# Altium schematic sheet Sintetizador1.SchDoc
size A4; SheetNumber: 11; SheetTotal: 13
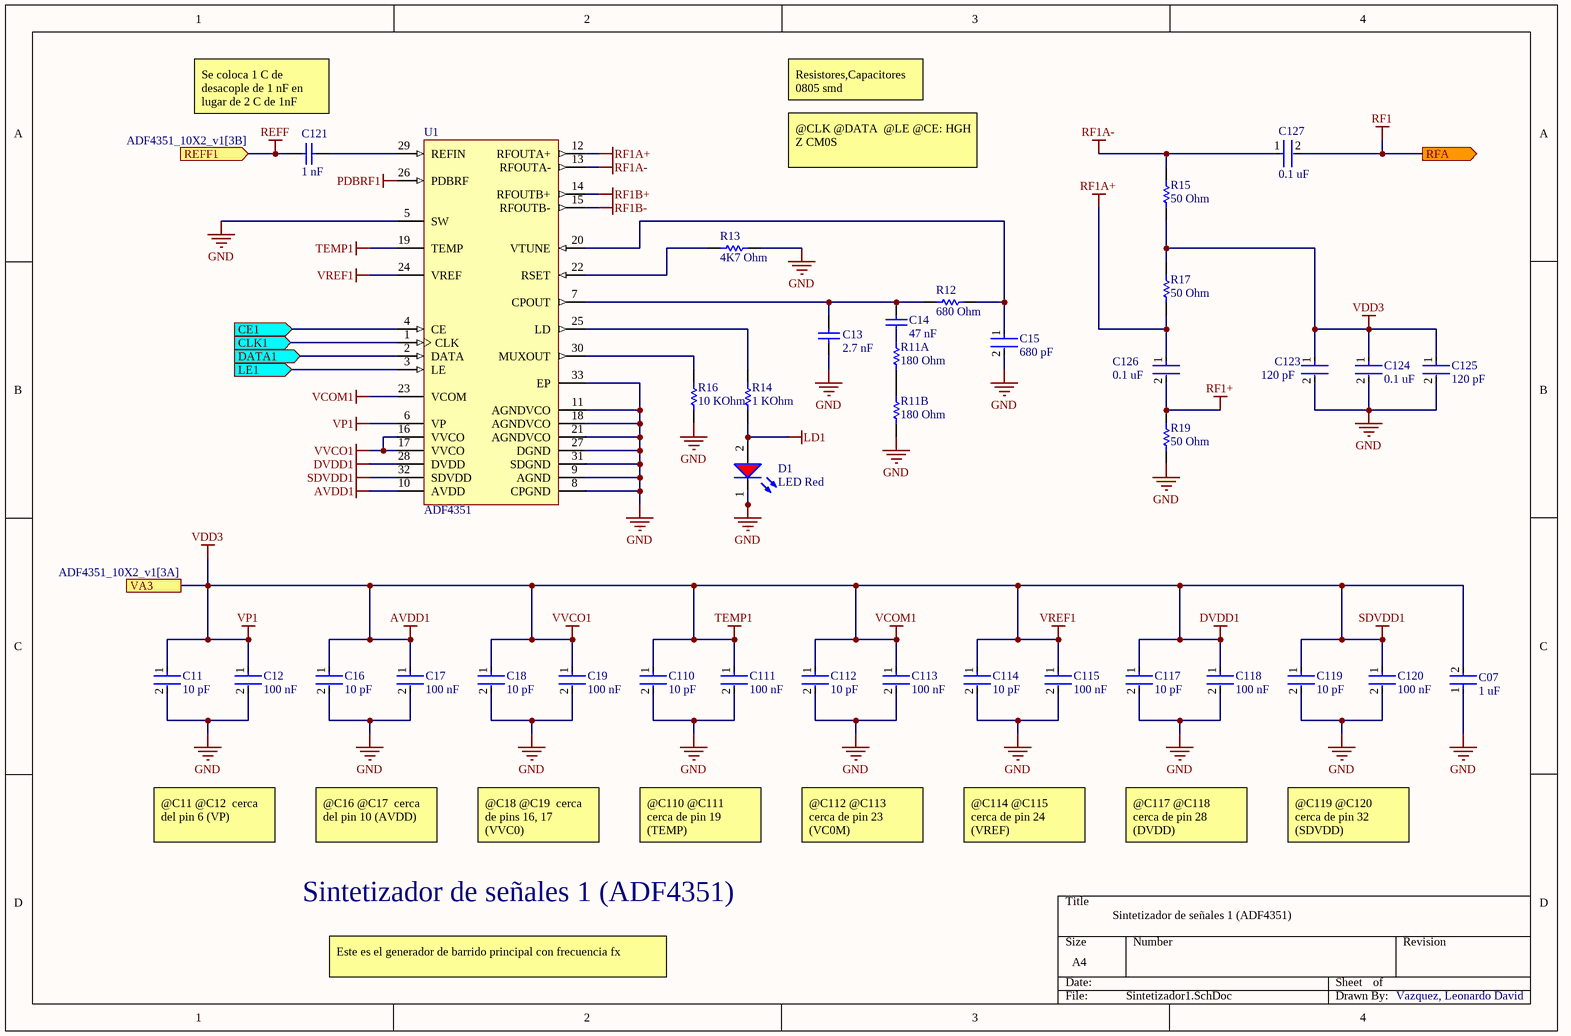
[diagram p0: Sintetizador1.SchDoc]

## Parts
C07  1 uF  [FP-CC0805-0_85-MFG]
C11  10 pF  [FP-CL21-IPC_C]
C12  100 nF  [FP-CL21-IPC_C]
C13  2.7 nF  [CAPC2013X130X50NL20T20]
C14  47 nF  [CAPC2013X100X50ML20T25]
C15  680 pF  [FP-C0805C-DN-MFG]
C16  10 pF  [FP-CL21-IPC_C]
C17  100 nF  [FP-CL21-IPC_C]
C18  10 pF  [FP-CL21-IPC_C]
C19  100 nF  [FP-CL21-IPC_C]
C110  10 pF  [FP-CL21-IPC_C]
C111  100 nF  [FP-CL21-IPC_C]
C112  10 pF  [FP-CL21-IPC_C]
C113  100 nF  [FP-CL21-IPC_C]
C114  10 pF  [FP-CL21-IPC_C]
C115  100 nF  [FP-CL21-IPC_C]
C117  10 pF  [FP-CL21-IPC_C]
C118  100 nF  [FP-CL21-IPC_C]
C119  10 pF  [FP-CL21-IPC_C]
C120  100 nF  [FP-CL21-IPC_C]
C121  1 nF  [CAPC2013X94X50NL20T25]
C123  120 pF  [FP-CC0805-0_85-MFG]
C124  0.1 uF  [FP-CC0805-0_85-MFG]
C125  120 pF  [FP-CC0805-0_85-MFG]
C126  0.1 uF  [FP-CC0805-0_85-MFG]
C127  0.1 uF  [FP-CC0805-0_85-MFG]
D1  LED Red  [WL-SMCW_0805_150080xx75000]
R11A  180 Ohm  [RESC2013X70X40ML20T20]
R11B  180 Ohm  [RESC2013X70X40ML20T20]
R12  680 Ohm  [RESC2013X70X40ML20T20]
R13  4K7 Ohm  [RESC2013X70X40ML20T20]
R14  1 KOhm  [RESC2013X60X40ML20T25]
R15  50 Ohm  [RESC2013X60X40ML20T25]
R16  10 KOhm  [RESC2013X60X40ML20T25]
R17  50 Ohm  [RESC2013X60X40ML20T25]
R19  50 Ohm  [RESC2013X60X40ML20T25]
U1  ADF4351  [ADI-CP-32-2_L]

## Ports
CE1 (in, see ADF4351_10X2_v1[3A], Data_converter[2A]), CLK1 (in, see ADF4351_10X2_v1[3A], Data_converter[2B]), DATA1 (in, see ADF4351_10X2_v1[3A], Data_converter[2B]), LE1 (in, see ADF4351_10X2_v1[3A], Data_converter[2C]), REFF1 (in, see ADF4351_10X2_v1[3B]), RFA (out, see ADF4351_10X2_v1[3A]), VA3 (see ADF4351_10X2_v1[3A])

## Nets
AVDD1: C07.2 C11.1 C12.1 C16.1 C17.1 C18.1 C19.1 C110.1 C111.1 C112.1 C113.1 C114.1 C115.1 C117.1 C118.1 C119.1 C120.1 C123.1 C124.1 C125.1 R15.2 R17.1 U1.6(VP) U1.10(AVDD) U1.16(VVCO) U1.17(VVCO) U1.19(TEMP) U1.23(VCOM) U1.24(VREF) U1.28(DVDD) U1.32(SDVDD) ; port VA3  [also labelled DVDD1, SDVDD1, TEMP1, VCOM1, VDD3, VP1, VREF1, VVCO1]
GND: C07.1 C11.2 C12.2 C13.1 C15.2 C16.2 C17.2 C18.2 C19.2 C110.2 C111.2 C112.2 C113.2 C114.2 C115.2 C117.2 C118.2 C119.2 C120.2 C123.2 C124.2 C125.2 D1.1(K) R11B.1 R13.2 R16.2 R19.2 U1.5(SW) U1.8(CPGND) U1.9(AGND) U1.11(AGNDVCO) U1.18(AGNDVCO) U1.21(AGNDVCO) U1.27(DGND) U1.31(SDGND) U1.33(EP)
LD1: D1.2(A) R14.1
PDBRF1: U1.26(PDBRF)
REFF: C121.1 ; port REFF1
RF1: C127.2 ; port RFA
RF1+: C126.2 R19.1
RF1A+: C126.1 R17.2 U1.12(RFOUTA+)
RF1A-: C127.1 R15.1 U1.13(RFOUTA-)
RF1B+: U1.14(RFOUTB+)
RF1B-: U1.15(RFOUTB-)
CE1: U1.4(CE) ; port CE1
CLK1: U1.1(CLK) ; port CLK1
DATA1: U1.2(DATA) ; port DATA1
LE1: U1.3(LE) ; port LE1
NetC13_2: C13.2 C14.2 R12.1 U1.7(CPOUT)
NetC14_1: C14.1 R11A.2
NetC15_1: C15.1 R12.2 U1.20(VTUNE)
NetC121_2: C121.2 U1.29(REFIN)
NetR11A_2: R11A.2 R11B.1
NetR13_1: R13.1 U1.22(RSET)
NetR14_2: R14.2 U1.25(LD)
NetR16_1: R16.1 U1.30(MUXOUT)

## Notes on the sheet
- (near C121) Se coloca 1 C de desacople de 1 nF en lugar de 2 C de 1nF
- Resistores,Capacitores 0805 smd
  2N3904 SOT-23
- @CLK @DATA  @LE @CE: HGH Z CM0S
- @C11 @C12  cerca del pin 6 (VP)
- @C16 @C17  cerca del pin 10 (AVDD)
- @C18 @C19  cerca de pins 16, 17 (VVC0)
- @C110 @C111  cerca de pin 19 (TEMP)
- @C112 @C113  cerca de pin 23 (VC0M)
- @C114 @C115  cerca de pin 24 (VREF)
- @C117 @C118  cerca de pin 28 (DVDD)
- @C119 @C120  cerca de pin 32 (SDVDD)
- Sintetizador de señales 1 (ADF4351)
- Este es el generador de barrido principal con frecuencia fx
- Vazquez, Leonardo David

## Library data of the parts
C07 C123-C127 = CMP-2100-03606-3: CAP CER 0.1UF 50V X7R 0805; Manufacturer Part Number: CC0805KRX7R9BB104; Manufacturer: Yageo; Tolerance: 0.1; Capacitance: 100 nF; Value: 100 nF; Material: Ceramic; Device Class L1: Passive Components; ComponentLink2Description: Datasheet; Package: CC0805-0.85; Digikey Description: CAP CER 0.1UF 50V X7R 0805; Device Class L3: Ceramic Capacitors; Temperature: -30°C to +85°C; Temperature Characteristic: X7R; Voltage Rating: 50 V; Height: 0.95mm; RoHS: TRUE; Ipc Land Pattern Name: CAPC200125X85; Device Class L2: Capacitors; Category: Cap; Temperature Range Low: -30°C; Temperature Range High: +85°C; Mouser Description: Multilayer Ceramic Capacitors MLCC - SMD/SMT 100nF 50V X7R 10%; Footprint Url: http://www.yageo.com/exep/pages/download/literatures/UPY-C_GEN_24.pdf; Automotive: No; Octopart: https://octopart.com/cc0805krx7r9bb104-yageo-192993; Lead Free: Yes; ComponentLink2URL: http://www.yageo.com/documents/recent/UPY-GPHC_Y5V_6.3V-to-50V_8.pdf
C11 C16 C18 C110 C112 C114 C117 C119 = CMP-13271-003234-1: CL21 Series 0805 10pF 100V ±0.25pF Tolerance C0G Multilayer Ceramic Chip Capacitor; Temperature Coefficient: 300ppm/°C; Length: 2mm; Packaging: Tape and Reel; Width: 0.049inch; Thickness: 0.03inch; Depth: 1.25mm; Case Code (Imperial): 0805; Package Quantity: 1; Capacitance: 10pF; Voltage: 100V; Case Code (Metric): 2012; Dielectric: C0G; Voltage Rating: 100V; Case/Package: 0805; Height: 0.65mm; Mount: Surface Mount; Radiation Hardening: No; Max Operating Temperature: 125°C; Voltage Rating (DC): 100V; Min Operating Temperature: -55°C; Material: Ceramic
C12 C17 C19 C111 C113 C115 C118 C120 = CMP-2100-03606-3: CAP CER 0.1UF 50V X7R 0805; Manufacturer Part Number: CC0805KRX7R9BB104; Manufacturer: Yageo; Tolerance: 0.1; Material: Ceramic; Device Class L1: Passive Components; ComponentLink2Description: Datasheet; Package: CC0805-0.85; Digikey Description: CAP CER 0.1UF 50V X7R 0805; Capacitance: 100 nF; Device Class L3: Ceramic Capacitors; Value: 100 nF; Temperature: -30°C to +85°C; Temperature Characteristic: X7R; Voltage Rating: 50 V; Height: 0.95mm; RoHS: TRUE; Ipc Land Pattern Name: CAPC200125X85; Device Class L2: Capacitors; Category: Cap; Temperature Range Low: -30°C; Temperature Range High: +85°C; Mouser Description: Multilayer Ceramic Capacitors MLCC - SMD/SMT 100nF 50V X7R 10%; Footprint Url: http://www.yageo.com/exep/pages/download/literatures/UPY-C_GEN_24.pdf; Automotive: No; Octopart: https://octopart.com/cc0805krx7r9bb104-yageo-192993; Lead Free: Yes; ComponentLink2URL: http://www.yageo.com/documents/recent/UPY-GPHC_Y5V_6.3V-to-50V_8.pdf
C13 = CMP-2007-03635-1: Part Number: CDR31BX272BKMSAJ; Manufacturer: Vitramon
C14 = CMP-2007-03713-1: Manufacturer: Kemet; Part Number: C0805F473K5RACTU
C15 = CMP-1036-02839-3: CAP CER 680PF 100V 5% NP0 0805; Manufacturer: KEMET; Manufacturer Part Number: C0805C681J1GACTU; Temperature Coefficient: 30ppm/°C; Temperature Characteristic: C0G; Material: Ceramic; Tolerance: 0.05; Voltage Rating: 100 V; Category: Cap; Package: C0805C-DN; Ipc Land Pattern Name: CAPC200125X78; Automotive: No; Device Class L3: Ceramic Capacitors; Digikey Description: CAP CER 680PF 100V 5% NP0 0805; ComponentLink2Description: Datasheet; Lead Free: Yes; Temperature: -55°C to +125°C; Device Class L2: Capacitors; Value: 680 pF; ComponentLink2URL: https://content.kemet.com/datasheets/KEM_C1003_C0G_SMD.pdf; Device Class L1: Passive Components; Mouser Description: Cap Ceramic 680pF 100V C0G 5% SMD 0805 125°C Plastic T/R; Octopart: https://octopart.com/c0805c681j1gactu-kemet-8375796; Temperature Range High: +125°C; RoHS: TRUE; Height: 0.88mm; Temperature Range Low: -55°C; Capacitance: 680 pF
C121 = CMP-2007-04125-1: Manufacturer: AVX Interconnect / Elco; Part Number: 08051A102J4T2A
D1 = CMP-1426-00011-2: NexarPartId: 29717781; Peak Wavelength: 630nm; Wavelength: 625nm; Viewing Angle: 140°; Test Current: 20mA; Forward Voltage: 2V; Forward Current: 100mA; Lens Style: Clear, Rectangular; Luminous Intensity: 150mcd; Max Reverse Voltage (DC): 5V; Length: 2mm; Case Code (Imperial): 0805; RoHS: Compliant; Max Operating Temperature: 85°C; Height: 700µm; Packaging: Tape and Reel; Color: Red; Case/Package: 0805; REACH SVHC: Unknown; Dominant Wavelength: 625nm; Min Operating Temperature: -40°C; Case Code (Metric): 2012; Mount: Surface Mount; Width: 1.25mm
R11A R11B = CMP-2001-00537-1: Manufacturer: Panasonic; Part Number: ERJ-6ENF3600V
R12 R13 = CMP-2001-00569-1: Part Number: ERJ6ENF6803V; Manufacturer: Panasonic
R14-R17 R19 = CMP-2001-00580-1: Manufacturer: Panasonic; Part Number: ERA6AEB101V
U1 = CMP-0287-00015-1: Wideband Synthesizer with Integrated VCO, CP-32-2, Pb-Free, 1500 Reel; Max RF Input (MHz): 4.4GHz; RF Prescalers: 4/5,8/9; Max REFin (MHz): 250MHz; Frequency Range: 35MHz-4.4GHz; Norm Phase Noise (dBc/Hz): -221dBc; Supply Current: 110mA; Single/Dual: Single; PackageVersion: Jan-2005; ComponentLink3URL: http://www.analog.com/static/imported-files/packages/414143737956480539664569CP_32_2.pdf; PackageReference: CP-32-2; ComponentLink2URL: http://www.analog.com/static/imported-files/data_sheets/ADF4351.pdf; ComponentLink1URL: www.analog.com; ComponentLink1Description: Manufacturer URL; ComponentLink2Description: Datasheet; ComponentLink3Description: Package Specification; PackageDescription: 32-Lead Lead Frame Chip Scale Package [LFCSP_VQ]; DatasheetVersion: Rev. Pr D; Code_JEDEC: MO-220-VHHD-2